# EAGLE design IRremote (EAGLE 6.6.0)
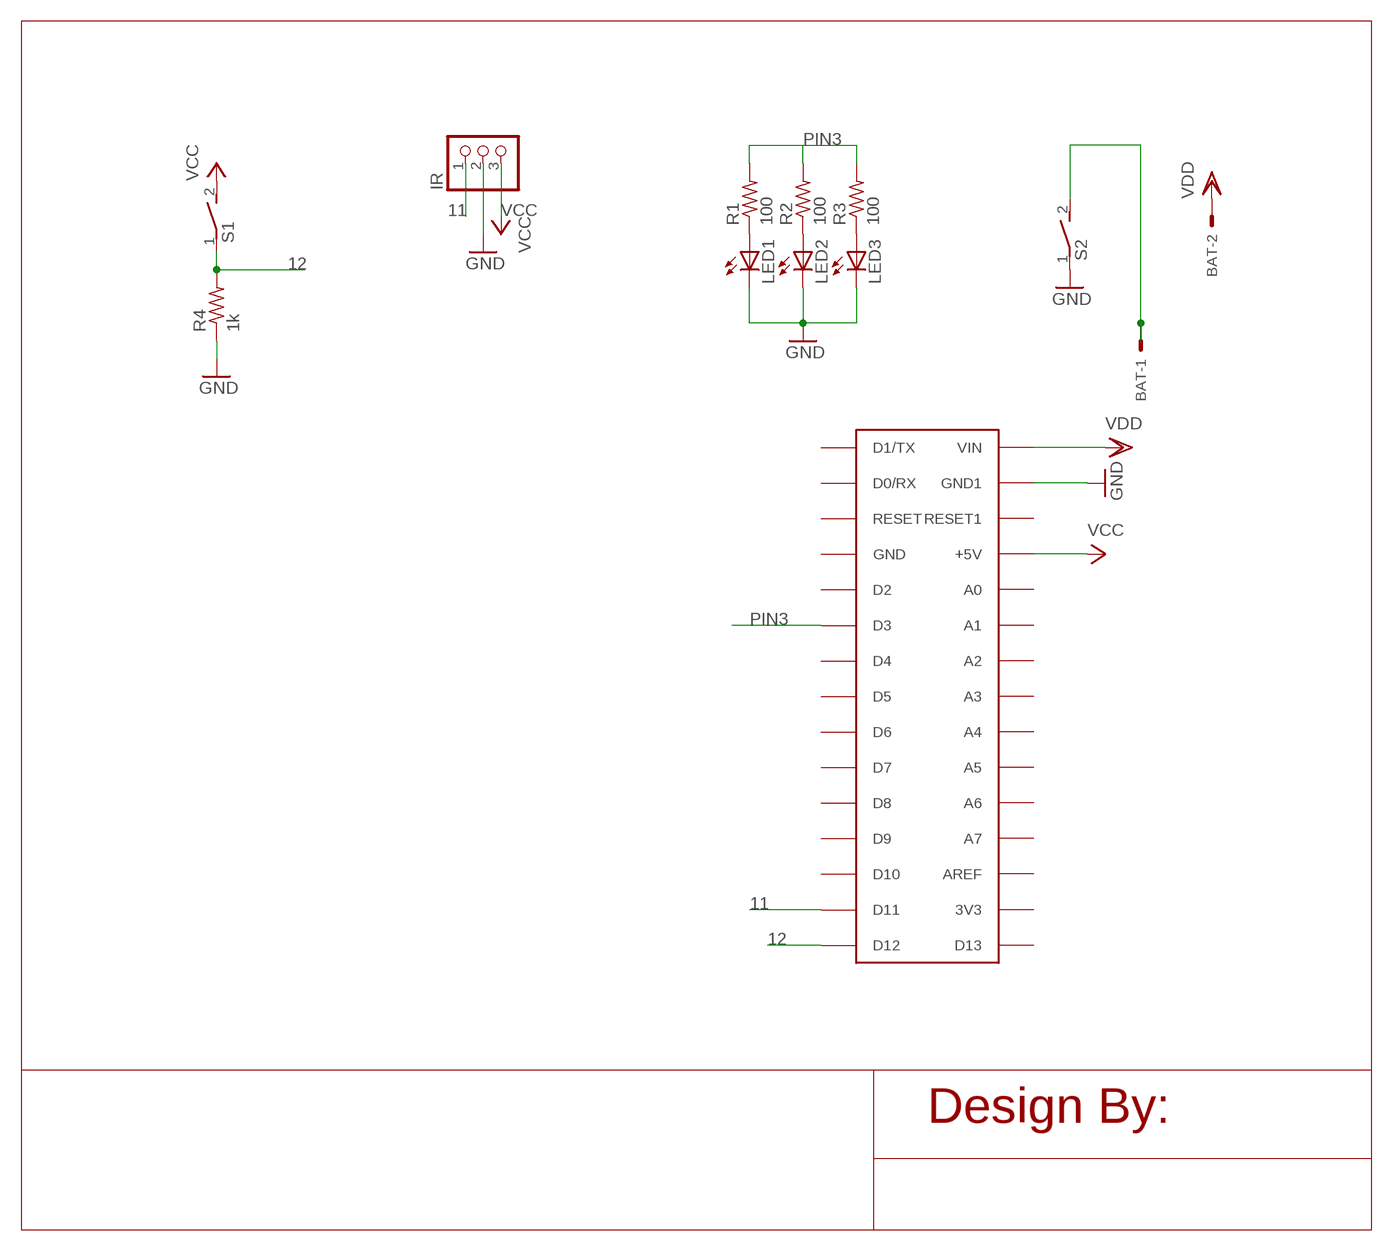
[diagram p0: schematic, sheet 1]

## Parts
ARDIUNO-NANO  ARDUINONANO  [PDIP-32]
BAT  22-23-2021  [22-23-2021]
IR  PINHD-1X3  [1X03]
LED1  LED5MM  [LED5MM]
LED2  LED5MM  [LED5MM]
LED3  LED5MM  [LED5MM]
R1  100  R-US_R0603  [R0603]
R2  100  R-US_R0603  [R0603]
R3  100  R-US_R0603  [R0603]
R4  1k  R-US_R0603  [R0603]
S1  DS01E  [DS-01]
S2  DS01E  [DS-01]

## Nets
11: ARDIUNO-NANO.D11 IR.1
12: ARDIUNO-NANO.D12 R4.2 S1.1
GND [power]: ARDIUNO-NANO.GND1 IR.2 LED1.K(C) LED2.K(C) LED3.K(C) R4.1 S2.1
N$1: LED1.A R1.1
N$2: LED2.A R2.1
N$3: LED3.A R3.1
N$5 [power]: BAT.1 S2.2
PIN3 [power]: ARDIUNO-NANO.D3 R1.2 R2.2 R3.2
VCC [power]: ARDIUNO-NANO.+5V IR.3 S1.2
VDD [power]: ARDIUNO-NANO.VIN BAT.2
Unconnected: ARDIUNO-NANO.3V3 ARDIUNO-NANO.A0 ARDIUNO-NANO.A1 ARDIUNO-NANO.A2 ARDIUNO-NANO.A3 ARDIUNO-NANO.A4 ARDIUNO-NANO.A5 ARDIUNO-NANO.A6 ARDIUNO-NANO.A7 ARDIUNO-NANO.AREF ARDIUNO-NANO.D0/RX ARDIUNO-NANO.D1/TX ARDIUNO-NANO.D2 ARDIUNO-NANO.D4 ARDIUNO-NANO.D5 ARDIUNO-NANO.D6 ARDIUNO-NANO.D7 ARDIUNO-NANO.D8 ARDIUNO-NANO.D9 ARDIUNO-NANO.D10 ARDIUNO-NANO.D13 ARDIUNO-NANO.GND ARDIUNO-NANO.RESET ARDIUNO-NANO.RESET1

## Notes on the sheet
- Design By:

## Library data of the parts
ARDIUNO-NANO = jet-lib:ARDUINONANO
BAT = con-molex:22-23-2021: .100" (2.54mm) Center Header - 2 Pin; MF: MOLEX; MPN: 22-23-2021; OC_FARNELL: 1462926; OC_NEWARK: 25C3832
IR = pinhead:PINHD-1X3: PIN HEADER
LED1-LED3 = led:LED: LED OSRAM: - CHIPLED LG R971, LG N971, LY N971, LG Q971, LY Q971, LO R971, LY R971 LH N974, LH R974 LS Q976, LO Q976, LY Q976 LO Q996 - Hyper CHIPLED LW Q18S LB Q993, LB Q99A, LB R99A - SideLED LS A670, LO A670, LY A670, LG A670, LP A670 LB A673, LV A673, LT A673, LW A673 LH A674 LY A675 LS A676, LA A676, LO A676, LY A676, LW A676 LS A679, LY A679, LG A679 - Hyper Micro SIDELED® LS Y876, LA Y876, LO Y876, LY Y876 LT Y87S - SmartLED LW L88C, LW L88S LB L89C, LB L89S, LG L890 LS L89K, LO L89K, LY L89K LS L896, LA L896, LO L896, LY L896 - TOPLED LS T670, LO T670, LY T670, LG T670, LP T670 LSG T670, LSP T670, LSY T670, LOP T670, LYG T670 LG T671, LOG T671, LSG T671 LB T673, LV T673, LT T673, LW T673 LH T674 LS T676, LA T676, LO T676, LY T676, LB T676, LH T676, LSB T676, LW T676 LB T67C, LV T67C, LT T67C, LS T67K, LO T67K, LY T67K, LW E67C LS E67B, LA E67B, LO E67B, LY E67B, LB E67C, LV E67C, LT E67C LW T67C LS T679, LY T679, LG T679 LS T770, LO T770, LY T770, LG T770, LP T770 LB T773, LV T773, LT T773, LW T773 LH T774 LS E675, LA E675, LY E675, LS T675 LS T776, LA T776, LO T776, LY T776, LB T776 LHGB T686 LT T68C, LB T68C - Hyper Mini TOPLED® LB M676 - Mini TOPLED Santana® LG M470 LS M47K, LO M47K, LY M47K Source: http://www.osram.convergy.de LUXEON: - LUMILED® LXK2-PW12-R00, LXK2-PW12-S00, LXK2-PW14-U00, LXK2-PW14-V00 LXK2-PM12-R00, LXK2-PM12-S00, LXK2-PM14-U00 LXK2-PE12-Q00, LXK2-PE12-R00, LXK2-PE12-S00, LXK2-PE14-T00, LXK2-PE14-U00 LXK2-PB12-K00, LXK2-PB12-L00, LXK2-PB12-M00, LXK2-PB14-N00, LXK2-PB14-P00, LXK2-PB14-Q00 LXK2-PR12-L00, LXK2-PR12-M00, LXK2-PR14-Q00, LXK2-PR14-R00 LXK2-PD12-Q00, LXK2-PD12-R00, LXK2-PD12-S00 LXK2-PH12-R00, LXK2-PH12-S00 LXK2-PL12-P00, LXK2-PL12-Q00, LXK2-PL12-R00 Source: www.luxeon.com KINGBRIGHT: KA-3528ASYC Source: www.kingbright.com
R1-R4 = rcl:R-US_: RESISTOR, American symbol
S1 S2 = switch-dil:DS01E: DIL/CODE SWITCH; OC_FARNELL: unknown; OC_NEWARK: unknown

## Net classes
0 default: width 0.508 mm, drill 0.508 mm, clearance 0.254 mm
1 power: width 0.762 mm, drill 0.762 mm, clearance 0.508 mm

## Board
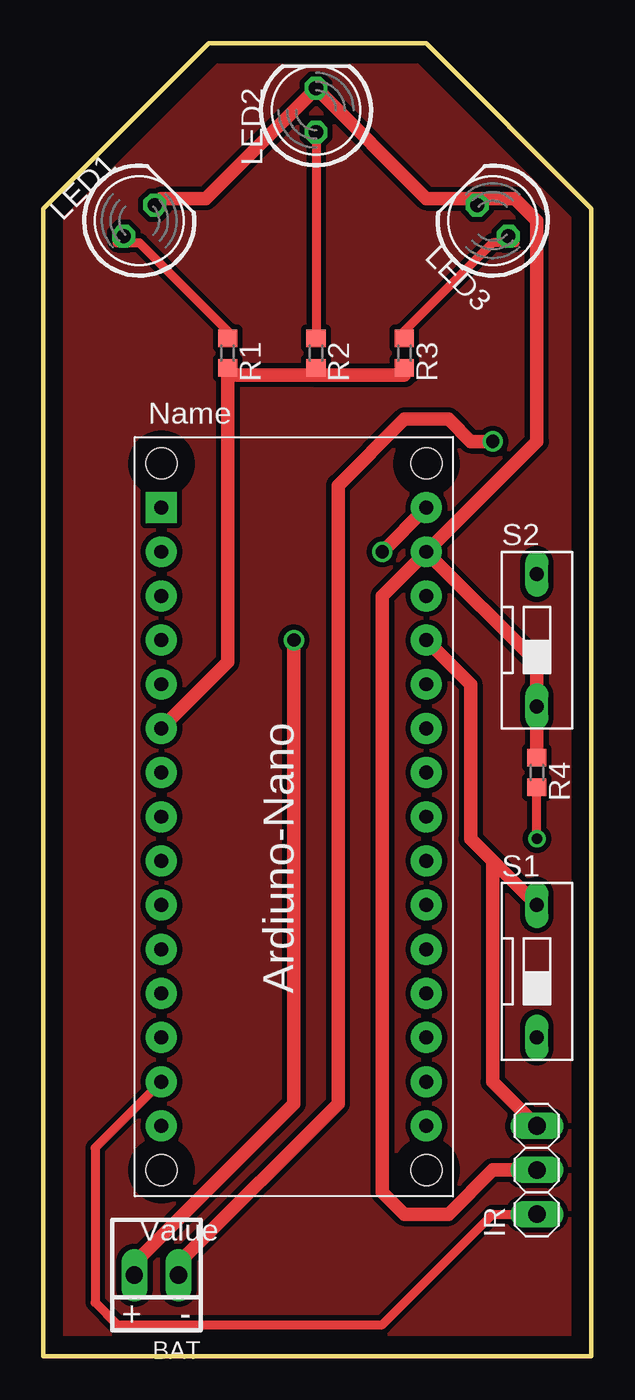
[diagram p1: board, top side]
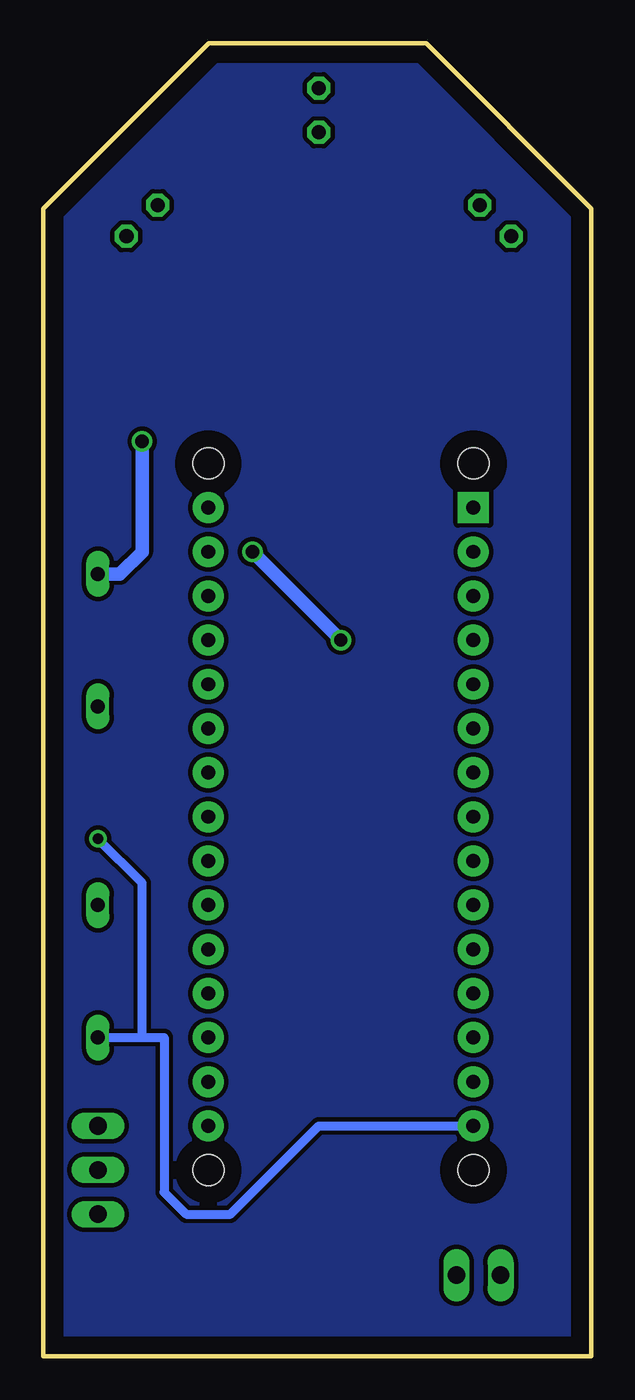
[diagram p2: board, bottom side, seen from below]

Size 31.5 x 75.5 mm. Coordinates in mm from the lower left corner, seen from the top.
Outline: 0,0 0,66 9.5,75.5 22,75.5 31.5,66 31.5,0 0,0
Copper layers (1*16): Top 0.035mm / dielectric 1.5mm / Bottom 0.035mm
Design rules "default": minimum track width 10mil, minimum drill 24mil, track to track 8mil, track to pad 8mil, pad to pad 8mil, via to via 8mil, smd to smd 8mil, copper to edge 40mil, drill to drill 8mil, minimum pad ring 10mil, minimum via ring 8mil, stop-mask expansion 4mil, vias tented up to drill 0mil, thermal gap 10mil

### Footprints (pad centres in the part's own frame; a part is rotated, then mirrored left to right if it is on the bottom)
PDIP-32 = drill 0.8 pad 1.778: 3V3 15.24,-35.56; +5V 15.24,-10.16; A0 15.24,-12.7; A1 15.24,-15.24; A2 15.24,-17.78; A3 15.24,-20.32; A4 15.24,-22.86; A5 15.24,-25.4; A6 15.24,-27.94; A7 15.24,-30.48; AREF 15.24,-33.02; D0/RX 0,-5.08; D2 0,-12.7; D3 0,-15.24; D4 0,-17.78; D5 0,-20.32; D6 0,-22.86; D7 0,-25.4; D8 0,-27.94; D9 0,-30.48; D10 0,-33.02; D11 0,-35.56; D12 0,-38.1; D13 15.24,-38.1; GND 0,-10.16; GND1 15.24,-5.08; RESET 0,-7.62; RESET1 15.24,-7.62; VIN 15.24,-2.54 | drill 0.8 pad 1.778 square: D1/TX 0,-2.54 | hole 1.778: 0,0; 0,-40.64; 15.24,-40.64; 15.24,0
22-23-2021 = drill 1 long: 1 -1.27,0; 2 1.27,0
1X03 = drill 1.016 long: 1 -2.54,0; 2 0,0; 3 2.54,0
LED5MM = drill 0.813 octagon: A -1.27,0; K 1.27,0
R0603 = smd 1 x 1.1: 1 -0.85,0; 2 0.85,0
DS-01 = drill 0.813 long: 1 0,-3.81; 2 0,3.81

### Placement (x,y rotation side)
ARDIUNO-NANO  6.78,51.34 0 top
BAT  6.49,4.65 180 top
IR  28.37,10.7 90 top
LED1  5.51,65.31 45 top
LED2  15.67,71.66 90 top
LED3  25.83,65.31 135 top
R1  10.59,57.69 270 top
R2  15.67,57.69 270 top
R3  20.75,57.69 270 top
R4  28.37,33.56 270 top
S1  28.37,22.13 0 top
S2  28.37,41.18 0 top

### Tracks (layer width: path | path; a pad name or v marks a point on that pad's centre or on a via)
11
  Top 0.508: IR.1 25.83,8.16 19.48,1.81 4.24,1.81 2.97,3.08 2.97,11.97 ARDIUNO-NANO.D11
12  (via drill 0.61)
  Top 0.508: v28.37,29.75 R4.2
  Bottom 0.508: v28.37,29.75 25.83,27.21 25.83,18.32 | S1.1 25.83,18.32 | ARDIUNO-NANO.D12 15.67,13.24 20.75,8.16 23.29,8.16 24.56,9.43 24.56,18.32 25.83,18.32
GND
  Top 0.762: LED1.K 6.78,66.58 9.32,66.58 LED2.K 22.02,66.58 24.56,66.58 | R4.1 S2.1 28.37,39.91 ARDIUNO-NANO.GND1 | IR.2 25.83,10.7 23.29,8.16 20.75,8.16 19.48,9.43 19.48,43.72 ARDIUNO-NANO.GND1 | 24.56,66.58 27.1,66.58 28.37,65.31 28.37,52.61 ARDIUNO-NANO.GND1 | 24.56,66.58 LED3.K
N$1
  Top 0.508: R1.1 10.59,58.96 5.51,64.04 4.24,64.04 LED1.A
N$2
  Top 0.508: LED2.A R2.1
N$3
  Top 0.508: R3.1 20.75,58.96 25.83,64.04 27.1,64.04 LED3.A
N$4
  pour Bottom: 0,66 0,0 31.5,0 31.5,66 31,66 22,75 9,75
N$5  (via drill 0.76)
  Top 0.762: v25.83,52.61 24.56,52.61 23.29,53.88 20.75,53.88 16.94,50.07 16.94,14.51 8.05,5.62 BAT.1
  Bottom 0.762: S2.2 27.1,44.99 25.83,46.26 v25.83,52.61
N$6
  pour Top (isolate 0.305): 0,0 31.5,0 31.5,66 31,66 21.5,75.5 9.5,75.5 0,66
PIN3
  Top 0.762: 15.67,56.42 10.59,56.42 | 15.67,56.42 20.75,56.42 R3.2 | 15.67,56.42 R2.2 | ARDIUNO-NANO.D3 10.59,39.91 10.59,56.42 | 10.59,56.42 R1.2
VCC
  Top 0.762: 25.83,28.48 24.56,29.75 24.56,38.64 ARDIUNO-NANO.+5V | 25.83,28.48 S1.2 | IR.3 25.83,15.78 25.83,28.48
VDD  (via drill 0.76)
  Top 0.762: v14.4,41.18 14.4,14.51 5.51,5.62 BAT.2 | ARDIUNO-NANO.VIN v19.48,46.26
  Bottom 0.762: v19.48,46.26 v14.4,41.18

### Text on the board
tNames: Ardiuno-Nano